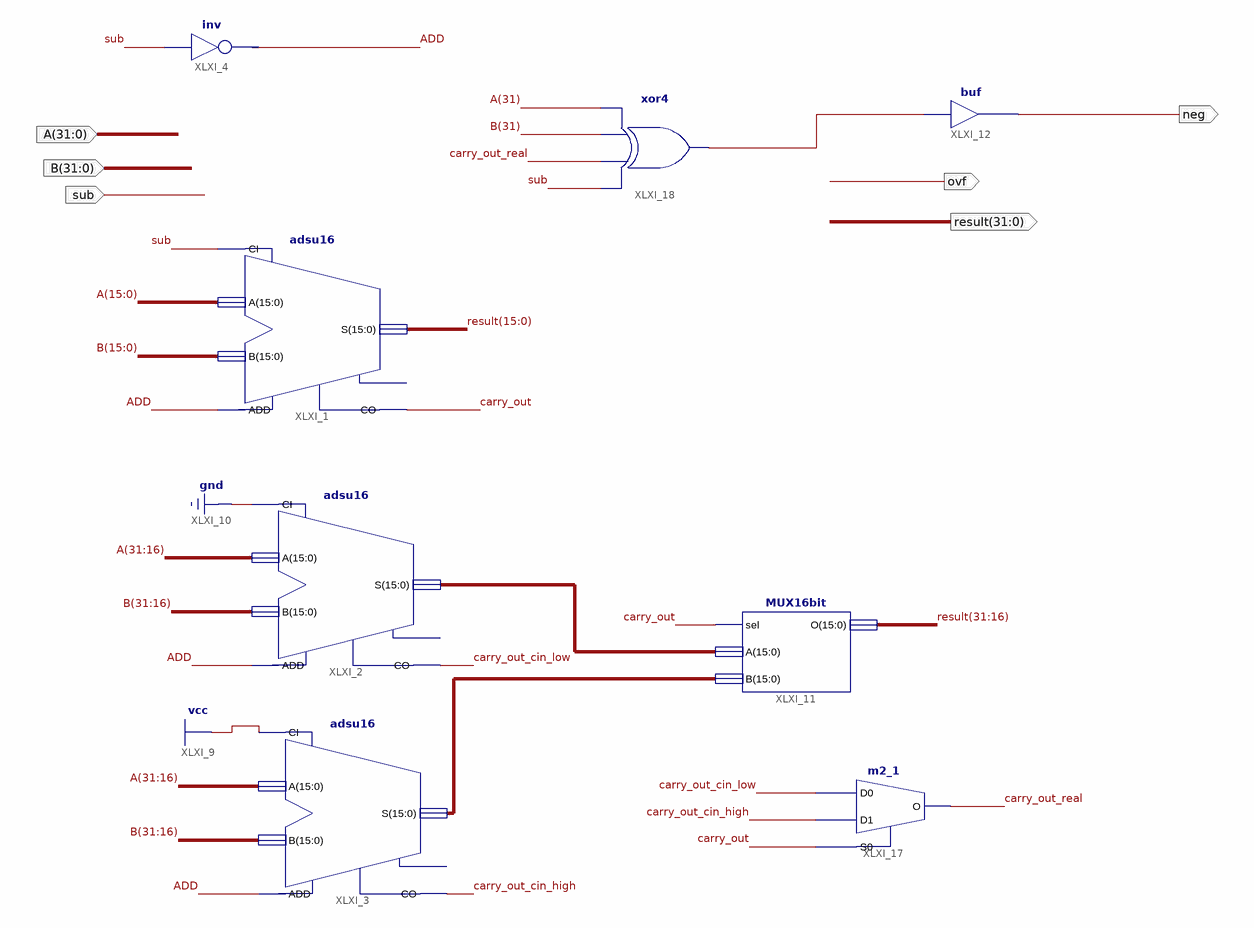
[diagram p0: schematic sheet 1]
// Xilinx ISE schematic ADD_SUB.sch (spartan6) as structural Verilog: 8 symbols, 6 ports
module ADD_SUB (
  input  [31:0] A,
  input  [31:0] B,
  input  sub,
  output ovf,
  output [31:0] result,
  output neg
);

  wire ADD, carry_out, carry_out_cin_high, carry_out_cin_low, carry_out_real, XLXN_51;
  wire [15:0] XLXN_36, XLXN_37;

  not XLXI_4 (ADD, sub);
  adsu16 XLXI_1 (.A(A[15:0]), .ADD(ADD), .B(B[15:0]), .CI(sub), .CO(carry_out), .S(result[15:0]));  // open: OFL
  adsu16 XLXI_2 (.A(A[31:16]), .ADD(ADD), .B(B[31:16]), .CI(1'b0), .CO(carry_out_cin_low), .S(XLXN_36));  // open: OFL
  adsu16 XLXI_3 (.A(A[31:16]), .ADD(ADD), .B(B[31:16]), .CI(1'b1), .CO(carry_out_cin_high), .S(XLXN_37));  // open: OFL
  MUX16bit XLXI_11 (.sel(carry_out), .A(XLXN_36), .B(XLXN_37), .O(result[31:16]));
  buf XLXI_12 (neg, XLXN_51);
  m2_1 XLXI_17 (.D0(carry_out_cin_low), .D1(carry_out_cin_high), .S0(carry_out), .O(carry_out_real));
  xor XLXI_18 (XLXN_51, sub, carry_out_real, B[31], A[31]);
endmodule
